# Altium schematic sheet LT3470.SchDoc
size A4
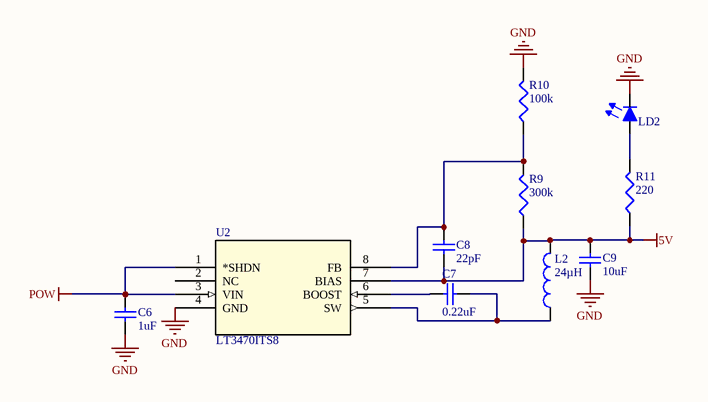
[diagram p0: LT3470.SchDoc]

## Parts
C6  1uF  [0805 CAP]
C7  0.22uF  [0805 CAP]
C8  22pF  [0805 CAP]
C9  10uF  [0805 CAP]
L2  value 24µH  [INDPM7070X580N]  (hidden comment: Inductance)
LD2  green  [LED_0603]  (value not drawn)
R9  value 300k  [0603 RES]  (hidden comment: Résistance)
R10  value 100k  [0603 RES]  (hidden comment: Résistance)
R11  value 220  [0603 RES]  (hidden comment: Résistance)
U2  LT3470ITS8  [TSOT-23_TS8]

## Nets
5V: C8.1 C9.1 L2.2 R9.1 R11.1 U2.7(BIAS)
GND: C6.1 C9.2 LD2.2(K) R10.2 U2.4(GND)
POW: C6.2 U2.1(*SHDN) U2.3(VIN)
NetC7_1: C7.1 U2.6(BOOST)
NetC7_2: C7.2 L2.1 U2.5(SW)
NetC8_2: C8.2 R9.2 R10.1 U2.8(FB)
NetLD2_1: LD2.1(A1) R11.2

Not connected (* = marked no-connect by the designer): U2 2(NC)

## Library data of the parts
C6 = 1uF/0805: Manufacturer: Murata; Manufacturer Part Number: GCM21BR7YA105KA55L; Capacitance: 1 µF; Dielectric: X7R; Tolerance (%): ±10 %; Rated Voltage: 35 V; Supplier 1: Farnell; Stock 1: 3630; Pricing 1: 5=0.391, 50=0.21, 250=0.162, 500=0.111 (EUR); Case Size/Dimension: 0805; ComponentLink1URL: https://datasheet.ciiva.com/11616/product-11616620.pdf; ComponentLink1Description: https://datasheet.ciiva.com/11616/product-11616620.pdf; ComponentLink2URL: https://datasheet.ciiva.com/138/s0717e-138752.pdf; ComponentLink2Description: https://datasheet.ciiva.com/138/s0717e-138752.pdf; ComponentLink3URL: https://datasheet.ciiva.com/138/s0717e-138753.pdf; ComponentLink3Description: https://datasheet.ciiva.com/138/s0717e-138753.pdf; ComponentLink4URL: https://datasheet.ciiva.com/18183/getdatasheetpartid-251151-18183719.pdf; ComponentLink4Description: https://datasheet.ciiva.com/18183/getdatasheetpartid-251151-18183719.pdf; ComponentLink5URL: https://datasheet.ciiva.com/138/s0717e-138751.pdf; ComponentLink5Description: https://datasheet.ciiva.com/138/s0717e-138751.pdf; Supplier Part Number 1: 2494199
C7 = 1uF/0805: Manufacturer: Murata; Manufacturer Part Number: GCM21BR7YA105KA55L; Capacitance: 0.22 µF; Dielectric: X7R; Tolerance (%): ±10 %; Rated Voltage: 35 V; Supplier 1: Farnell; Stock 1: 3630; Pricing 1: 5=0.391, 50=0.21, 250=0.162, 500=0.111 (EUR); Case Size/Dimension: 0805; ComponentLink1URL: https://datasheet.ciiva.com/11616/product-11616620.pdf; ComponentLink1Description: https://datasheet.ciiva.com/11616/product-11616620.pdf; ComponentLink2URL: https://datasheet.ciiva.com/138/s0717e-138752.pdf; ComponentLink2Description: https://datasheet.ciiva.com/138/s0717e-138752.pdf; ComponentLink3URL: https://datasheet.ciiva.com/138/s0717e-138753.pdf; ComponentLink3Description: https://datasheet.ciiva.com/138/s0717e-138753.pdf; ComponentLink4URL: https://datasheet.ciiva.com/18183/getdatasheetpartid-251151-18183719.pdf; ComponentLink4Description: https://datasheet.ciiva.com/18183/getdatasheetpartid-251151-18183719.pdf; ComponentLink5URL: https://datasheet.ciiva.com/138/s0717e-138751.pdf; ComponentLink5Description: https://datasheet.ciiva.com/138/s0717e-138751.pdf; Supplier Part Number 1: 2494199
C8 = 1uF/0805: Manufacturer: Murata; Manufacturer Part Number: GCM21BR7YA105KA55L; Dielectric: X7R; Tolerance (%): ±10 %; Rated Voltage: 35 V; Supplier 1: Farnell; Stock 1: 3630; Pricing 1: 5=0.391, 50=0.21, 250=0.162, 500=0.111 (EUR); Capacitance: 22 pF; Case Size/Dimension: 0805; ComponentLink1URL: https://datasheet.ciiva.com/11616/product-11616620.pdf; ComponentLink1Description: https://datasheet.ciiva.com/11616/product-11616620.pdf; ComponentLink2URL: https://datasheet.ciiva.com/138/s0717e-138752.pdf; ComponentLink2Description: https://datasheet.ciiva.com/138/s0717e-138752.pdf; ComponentLink3URL: https://datasheet.ciiva.com/138/s0717e-138753.pdf; ComponentLink3Description: https://datasheet.ciiva.com/138/s0717e-138753.pdf; ComponentLink4URL: https://datasheet.ciiva.com/18183/getdatasheetpartid-251151-18183719.pdf; ComponentLink4Description: https://datasheet.ciiva.com/18183/getdatasheetpartid-251151-18183719.pdf; ComponentLink5URL: https://datasheet.ciiva.com/138/s0717e-138751.pdf; ComponentLink5Description: https://datasheet.ciiva.com/138/s0717e-138751.pdf; Supplier Part Number 1: 2494199
C9 = 1uF/0805: Manufacturer: Murata; Manufacturer Part Number: GCM21BR7YA105KA55L; Capacitance: 10 µF; Dielectric: X7R; Tolerance (%): ±10 %; Rated Voltage: 35 V; Supplier 1: Farnell; Stock 1: 3630; Pricing 1: 5=0.391, 50=0.21, 250=0.162, 500=0.111 (EUR); Case Size/Dimension: 0805; ComponentLink1URL: https://datasheet.ciiva.com/11616/product-11616620.pdf; ComponentLink1Description: https://datasheet.ciiva.com/11616/product-11616620.pdf; ComponentLink2URL: https://datasheet.ciiva.com/138/s0717e-138752.pdf; ComponentLink2Description: https://datasheet.ciiva.com/138/s0717e-138752.pdf; ComponentLink3URL: https://datasheet.ciiva.com/138/s0717e-138753.pdf; ComponentLink3Description: https://datasheet.ciiva.com/138/s0717e-138753.pdf; ComponentLink4URL: https://datasheet.ciiva.com/18183/getdatasheetpartid-251151-18183719.pdf; ComponentLink4Description: https://datasheet.ciiva.com/18183/getdatasheetpartid-251151-18183719.pdf; ComponentLink5URL: https://datasheet.ciiva.com/138/s0717e-138751.pdf; ComponentLink5Description: https://datasheet.ciiva.com/138/s0717e-138751.pdf; Supplier Part Number 1: 2494199
LD2 = LED diode: LED green; Manufacturer: Multicomp; Manufacturer Part Number: 703-0112; LED Colour: Red; LED Mounting: SMD; Forward Current If: 20mA; Forward Voltage: 1.8V; Wavelength Typ: 643nm; Luminous Intensity: 15mcd; Viewing Angle: 140°; Lens Shape: Rectangular; Supplier 1: Farnell; Stock 1: 627; Pricing 1: 5=0.163, 25=0.139, 100=0.108, 250=0.0887, 500=0.0813, 1000=0.075 (EUR); Bulb Size: -; Packaging: Each; Product Range: -; Automotive Qualification Standard: -; ComponentLink1URL: https://datasheet.ciiva.com/1244/1758066-1244070.pdf; ComponentLink1Description: https://datasheet.ciiva.com/1244/1758066-1244070.pdf; ComponentLink2URL: https://datasheet.ciiva.com/23621/1626779-23621468.pdf; ComponentLink2Description: https://datasheet.ciiva.com/23621/1626779-23621468.pdf; Supplier Part Number 1: 2112124
R9-R11 = Résistance: Résistance standard; Designer: ECAM 2005; Type: Résistance standard
U2 = LT3470ITS8: No Description Available; Vendor: Linear Technology; Manufacturer_Part_Number: LT3470ITS8; Copyright: Copyright (C) 2018 Accelerated Designs. All rights reserved; RefDes: RefDes; Type: DEV; Value: Value
L2 = Inductance: Designer: ECAM 2003